# Altium project TIDA_00620.PrjPcb (part 3 of 8)
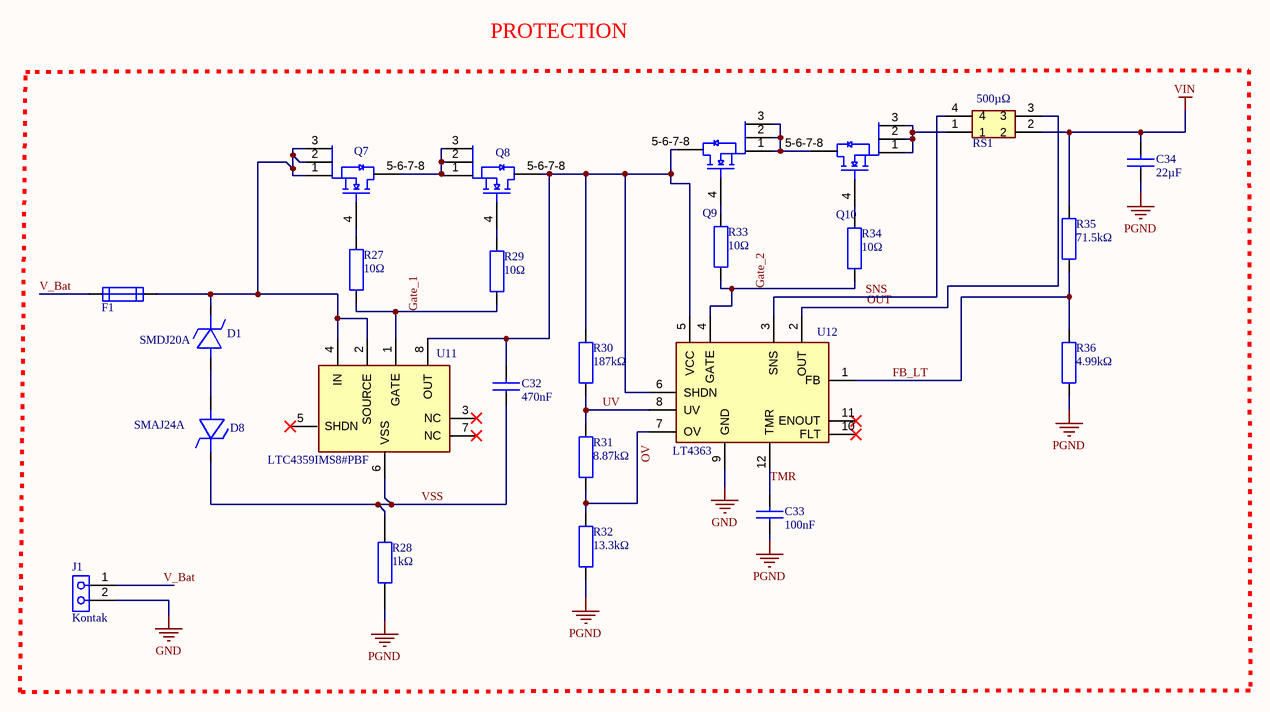
[diagram p6: Koruma.SchDoc]

## Sheet Koruma.SchDoc (continued)

### Library data of the parts (continued)
R36 = ERJ-2RKF4991X: Res Thick Film 0402 4.99K Ohm 1% 0.1W(1/10W) ±100ppm/C Pad SMD Automotive T/R; Manufacturer: Panasonic; Manufacturer Part Number: ERJ2RKF4991X; Manufacturer Lifecycle Status: ACTIVE; Part Series: Precision Thick Film Chip Resistors; Max Power Dissipation: 100mW; Temperature Coefficient: 100ppm/°C; Voltage Rating: 50V; Supplier: Farnell; Supplier Part Number: ERJ2RKF4991X; RoHS: Compliant; Category: Chip SMD Resistors; Stock: 140569; Pricing: 10=0,0178, 100=0,0146, 500=0,0095, 2500=0,0084, 5000=0,0074 (EUR); Case/Package: 0402; Case Code (Imperial): 0402; China RoHS: Non-Compliant; Composition: Thick Film; Contact Plating: Tin; Country of Origin: Japan, Mainland China; Depth: 500µm; Export Control Classification Number (ECCN) Code: EAR99; Features: Automotive AEC-Q200; Height: 350µm; Harmonized Tariff Schedule (HTS) Code: 8533.21.00.30; Introduction Date: 2004-02-02; Lead Free: Lead Free; Length: 1mm; Lifecycle Status: Production; Max Operating Temperature: 155°C; Military Standard: Not; Min Operating Temperature: -55°C; Mounting Technology: Surface Mount; Pins: 2; Number of Terminals: 2; Number of Terminations: 2; Packaging: Cut Tape; Power Rating: 100mW; Radiation Hardening: No; Ratings: AEC-Q200; REACH SVHC: Yes; Schedule B: 8533210045, 8533210045|8533210045|8533210045|8533210045|8533210045; Termination: SMD/SMT; Tolerance: 1%; Voltage Rating (DC): 50V; Weight: 793.786648µg; Width: 500µm; Working Voltage: 50V; ComponentLink1URL: https://sigma.octopart.com:443/138766958/technical_drawing/Panasonic-ERJ-2RKF4991X.pdf?src-supplier=Upverter; ComponentLink1Description: https://sigma.octopart.com:443/138766958/technical_drawing/Panasonic-ERJ-2RKF4991X.pdf?src-supplier=Upverter; ComponentLink2URL: https://datasheet.octopart.com:443/ERJ2RKF4991X-Panasonic-datasheet-82288794.pdf?src-supplier=Upverter; ComponentLink2Description: https://datasheet.octopart.com:443/ERJ2RKF4991X-Panasonic-datasheet-82288794.pdf?src-supplier=Upverter; ComponentLink3URL: https://datasheet.octopart.com:443/ERJ2RKF4991X-Panasonic-datasheet-13266541.pdf?src-supplier=RS+(Formerly+Allied+Electronics); ComponentLink3Description: https://datasheet.octopart.com:443/ERJ2RKF4991X-Panasonic-datasheet-13266541.pdf?src-supplier=RS+(Formerly+Allied+Electronics); ComponentLink4URL: https://datasheet.octopart.com:443/ERJ2RKF4991X-Panasonic-datasheet-48891056.pdf?src-supplier=Newark; ComponentLink4Description: https://datasheet.octopart.com:443/ERJ2RKF4991X-Panasonic-datasheet-48891056.pdf?src-supplier=Newark; ComponentLink5URL: https://datasheet.octopart.com:443/ERJ2RKF4991X-Panasonic-datasheet-136608610.pdf?src-supplier=Newark; ComponentLink5Description: https://datasheet.octopart.com:443/ERJ2RKF4991X-Panasonic-datasheet-136608610.pdf?src-supplier=Newark; ComponentLink6URL: https://datasheet.octopart.com:443/ERJ2RKF4991X-Panasonic-datasheet-10025800.pdf?src-supplier=Future+Electronics; ComponentLink6Description: https://datasheet.octopart.com:443/ERJ2RKF4991X-Panasonic-datasheet-10025800.pdf?src-supplier=Future+Electronics; ComponentLink7URL: https://datasheet.octopart.com:443/ERJ2RKF4991X-Panasonic-datasheet-8853621.pdf?src-supplier=Future+Electronics; ComponentLink7Description: https://datasheet.octopart.com:443/ERJ2RKF4991X-Panasonic-datasheet-8853621.pdf?src-supplier=Future+Electronics; ComponentLink8URL: https://datasheet.octopart.com:443/ERJ2RKF4991X-Panasonic-datasheet-5313456.pdf?src-supplier=Future+Electronics; ComponentLink8Description: https://datasheet.octopart.com:443/ERJ2RKF4991X-Panasonic-datasheet-5313456.pdf?src-supplier=Future+Electronics; ComponentLink9URL: https://datasheet.octopart.com:443/ERJ-2RKF4991X-Panasonic-datasheet-154766169.pdf?src-supplier=Master+Electronics; ComponentLink9Description: https://datasheet.octopart.com:443/ERJ-2RKF4991X-Panasonic-datasheet-154766169.pdf?src-supplier=Master+Electronics; ComponentLink10URL: https://datasheet.octopart.com:443/ERJ2RKF4991X-Panasonic-datasheet-188592431.pdf?src-supplier=TME; ComponentLink10Description: https://datasheet.octopart.com:443/ERJ2RKF4991X-Panasonic-datasheet-188592431.pdf?src-supplier=TME; ComponentLink11URL: https://datasheet.octopart.com:443/ERJ2RKF4991X-Panasonic-datasheet-164353789.pdf?src-supplier=TME; ComponentLink11Description: https://datasheet.octopart.com:443/ERJ2RKF4991X-Panasonic-datasheet-164353789.pdf?src-supplier=TME; ComponentLink12URL: https://datasheet.octopart.com/ERJ2RKF4991X-Panasonic-datasheet-78375410.pdf; ComponentLink12Description: https://datasheet.octopart.com/ERJ2RKF4991X-Panasonic-datasheet-78375410.pdf; ComponentLink13URL: https://datasheet.octopart.com/Precision-Thick-Film-Chip-Resistors-Panasonic-datasheet-family-106.pdf; ComponentLink13Description: https://datasheet.octopart.com/Precision-Thick-Film-Chip-Resistors-Panasonic-datasheet-family-106.pdf; ComponentLink14URL: https://datasheet.octopart.com:443/ERJ-2RKF4991X-Panasonic---ECG-datasheet-15994758.pdf?src-supplier=Farnell; ComponentLink14Description: https://datasheet.octopart.com:443/ERJ-2RKF4991X-Panasonic---ECG-datasheet-15994758.pdf?src-supplier=Farnell; ComponentLink15URL: https://datasheet.octopart.com:443/ERJ-2RKF4991X-Panasonic-datasheet-11542829.pdf?src-supplier=Arrow+Electronics; ComponentLink15Description: https://datasheet.octopart.com:443/ERJ-2RKF4991X-Panasonic-datasheet-11542829.pdf?src-supplier=Arrow+Electronics; ComponentLink16URL: https://datasheet.octopart.com:443/ERJ-2RKF4991X-Panasonic-datasheet-118621.pdf?src-supplier=DigiKey; ComponentLink16Description: https://datasheet.octopart.com:443/ERJ-2RKF4991X-Panasonic-datasheet-118621.pdf?src-supplier=DigiKey; ComponentLink17URL: https://datasheet.octopart.com:443/ERJ-2RKF4991X-Panasonic-datasheet-41391857.pdf?src-supplier=Electro+Sonic; ComponentLink17Description: https://datasheet.octopart.com:443/ERJ-2RKF4991X-Panasonic-datasheet-41391857.pdf?src-supplier=Electro+Sonic
RS1 = WSLP4026L5000FEA: Res Metal Strip 4026 0.0005 Ohm 1% 7W ±75ppm/C Metal Pad SMD Automotive T/R; Manufacturer: Vishay; Temperature Coefficient: 75ppm/°C; Working Voltage: 59.2mV; Supplier: Future Electronics; Supplier Part Number: WSLP4026L5000FEA; Manufacturer Part Number: WSLP4026L5000FEA; RoHS: Compliant; Category: Chip SMD Resistors; Pricing: 1500=2 (USD); Case/Package: 4026; Case Code (Imperial): 4026; Case Code (Metric): 1066; China RoHS: Compliant; Composition: Metal Strip; Features: Moisture Resistant; Height: 2.95mm; Length: 10.1mm; Lifecycle Status: Production; Max Operating Temperature: 170°C; Max Power Dissipation: 7W; Min Operating Temperature: -65°C; Mounting Technology: Surface Mount; Number of Terminals: 4; Number of Terminations: 4; Power Rating: 7W; Ratings: AEC-Q200; REACH SVHC: Yes; Tolerance: 1%; Width: 6.6mm; ComponentLink1URL: https://datasheet.octopart.com:443/WSLP4026L5000FEA-Vishay-datasheet-181963782.pdf?src-supplier=IHS; ComponentLink1Description: https://datasheet.octopart.com:443/WSLP4026L5000FEA-Vishay-datasheet-181963782.pdf?src-supplier=IHS; ComponentLink2URL: https://datasheet.octopart.com:443/WSLP4026L5000FEA-Vishay-datasheet-62319862.pdf?src-supplier=Newark; ComponentLink2Description: https://datasheet.octopart.com:443/WSLP4026L5000FEA-Vishay-datasheet-62319862.pdf?src-supplier=Newark; ComponentLink3URL: https://datasheet.octopart.com:443/WSLP4026L5000FEA-Vishay-datasheet-25365648.pdf?src-supplier=Newark; ComponentLink3Description: https://datasheet.octopart.com:443/WSLP4026L5000FEA-Vishay-datasheet-25365648.pdf?src-supplier=Newark; ComponentLink4URL: https://datasheet.octopart.com:443/WSLP4026L5000FEA-Vishay-datasheet-179246766.pdf?src-supplier=TME; ComponentLink4Description: https://datasheet.octopart.com:443/WSLP4026L5000FEA-Vishay-datasheet-179246766.pdf?src-supplier=TME; ComponentLink5URL: https://datasheet.octopart.com:443/WSLP4026L5000FEA-Vishay-datasheet-83134227.pdf?src-supplier=Future+Electronics; ComponentLink5Description: https://datasheet.octopart.com:443/WSLP4026L5000FEA-Vishay-datasheet-83134227.pdf?src-supplier=Future+Electronics; ComponentLink6URL: http://sigma.octopart.com:80/rohs_statement/Vishay-company-15.pdf?src-supplier=Compliance+Statements; ComponentLink6Description: http://sigma.octopart.com:80/rohs_statement/Vishay-company-15.pdf?src-supplier=Compliance+Statements
U11 = LTC4359IMS8#PBF: OR Controller N-Channel Single Automotive 8-Pin MSOP Tube / IC OR CTRLR N+1 8MSOP; Manufacturer: Analog Devices; Manufacturer Lifecycle Status: PRODUCTION; Max Output current: 180mA; Max Supply Voltage: 80V; Min Supply Voltage: 4V; Nominal Supply Current: 150µA; Number of Drivers: 1; Turn-Off Delay Time: 500ns; Supplier: Farnell; Supplier Part Number: LTC4359IMS8#PBF; Manufacturer Part Number: LTC4359IMS8#PBF; RoHS: Compliant; Category: Hot Swap Controllers; Stock: 348; Pricing: 1=9,08, 10=7,02, 50=6,69, 100=5,8, 250=5,55, 500=5,44 (EUR); Case/Package: MSOP; Lead Free: Lead Free; Lifecycle Status: Production; Max Operating Temperature: 85°C; Min Operating Temperature: -40°C; Number of Outputs: 1; Pins: 8; Schedule B: 8542310000, 8542390000, 8542390000|8542390000|8542390000|8542390000|8542390000|8542390000|8542390000|8542390000|8542390000|8542390000|8542390000|8542390000|8542390000|8542390000|8542390000|8542390000|8542390000|8542390000|8542390000|8542390000|8542390000|8542390000|8542390000|85; ComponentLink1URL: https://octopart.com:443/opatz8j6/c1?t=_P40TfJSJXDZt56jomm_QCaV2W9ovGhsmmsOr-jhAwoCJ8nBLABmPJZhMtd9jjF5hxL1_00-h1PSZMWNgisxjLor_nTRai5VSPSv7C30GKc6fB5Irl3JnoxXP6guWu3apPr0PFiiVpLUoXbJVRp6NFZQZkSSQtA-ym9nyDkwm4hFZ6aPWkuTkGMSIQRbKLFRiG3TpYClyGIEk8cre1-RNpxUfVtqVrzznXBdFvjW7k8HJfomxoh2QY9RslEN6MsN_sQCc8xlBgnroxPUy_RknD4svorm-bCFLp_eYvwDcJ65KenarPCoDA&src-supplier=Analog+Devices; ComponentLink1Description: https://octopart.com:443/opatz8j6/c1?t=_P40TfJSJXDZt56jomm_QCaV2W9ovGhsmmsOr-jhAwoCJ8nBLABmPJZhMtd9jjF5hxL1_00-h1PSZMWNgisxjLor_nTRai5VSPSv7C30GKc6fB5Irl3JnoxXP6guWu3apPr0PFiiVpLUoXbJVRp6NFZQZkSSQtA-ym9nyDkwm4hFZ6aPWkuTkGMSIQRbKLFRiG3TpYClyGIEk8cre1-RNpxUfVtqVrzznXBdFvjW7k8HJfomxoh2QY9RslEN6MsN_sQCc8xlBgnroxPUy_RknD4svorm-bCFLp_eYvwDcJ65KenarPCoDA&src-supplier=Analog+Devices; ComponentLink2URL: https://datasheet.octopart.com:443/LTC4359IMS8%23PBF-Analog-Devices-datasheet-140795748.pdf?src-supplier=element14+APAC; ComponentLink2Description: https://datasheet.octopart.com:443/LTC4359IMS8%23PBF-Analog-Devices-datasheet-140795748.pdf?src-supplier=element14+APAC; ComponentLink3URL: https://datasheet.octopart.com:443/LTC4359IMS8%23PBF-Analog-Devices-datasheet-158590489.pdf?src-supplier=Augswan; ComponentLink3Description: https://datasheet.octopart.com:443/LTC4359IMS8%23PBF-Analog-Devices-datasheet-158590489.pdf?src-supplier=Augswan; ComponentLink4URL: https://datasheet.octopart.com:443/LTC4359IMS8%23PBF-Linear-Technology-datasheet-57717354.pdf?src-supplier=Linear+Technology; ComponentLink4Description: https://datasheet.octopart.com:443/LTC4359IMS8%23PBF-Linear-Technology-datasheet-57717354.pdf?src-supplier=Linear+Technology; ComponentLink5URL: https://sigma.octopart.com:443/57689691/technical_drawing/Linear-Technology-LTC4359IMS8%23PBF.pdf?src-supplier=Linear+Technology; ComponentLink5Description: https://sigma.octopart.com:443/57689691/technical_drawing/Linear-Technology-LTC4359IMS8%23PBF.pdf?src-supplier=Linear+Technology; ComponentLink6URL: https://datasheet.octopart.com:443/LTC4359IMS8%23PBF-Linear-Technology-datasheet-11773680.pdf?src-supplier=Arrow+Electronics; ComponentLink6Description: https://datasheet.octopart.com:443/LTC4359IMS8%23PBF-Linear-Technology-datasheet-11773680.pdf?src-supplier=Arrow+Electronics; ComponentLink7URL: https://datasheet.octopart.com:443/LTC4359IMS8%23PBF-Analog-Devices-datasheet-14357927.pdf?src-supplier=Newchip+Electronics+Limited; ComponentLink7Description: https://datasheet.octopart.com:443/LTC4359IMS8%23PBF-Analog-Devices-datasheet-14357927.pdf?src-supplier=Newchip+Electronics+Limited; ComponentLink8URL: http://sigma.octopart.com:80/conflict_mineral_statement/Analog-Devices-company-33.pdf?src-supplier=Compliance+Statements; ComponentLink8Description: http://sigma.octopart.com:80/conflict_mineral_statement/Analog-Devices-company-33.pdf?src-supplier=Compliance+Statements; ComponentLink9URL: https://octopart.com:443/opatz8j6/c1?t=XMv486en4cgRczUhByXESygA7tzcWfPA65o52ghxq4CXCY5NS57rdy5GGbwVE8XfZyKs-Pss4HrKqDtDv8emV_VCOba_2B0i215LcHmypdXyqbKoV6hHKkyeszMd1G80nbJlVl28xOaq3ImAQwkx3MBKoeKSCRUWEeTh7O6SnaO6lulbOrhBpa7lUpYX2qexamutmNVBBP7Kuf_BfwVA6xNgWJaaLpoQaJnsVBxMCYgV8GT8S6w0VND9CLazxAvXxfuvXrc9_2mcoElFnkU-aAFDwJb3cbIgcdgtTW9GLMnN3gYe9mDzlQ&src-supplier=Compliance+Statements; ComponentLink9Description: https://octopart.com:443/opatz8j6/c1?t=XMv486en4cgRczUhByXESygA7tzcWfPA65o52ghxq4CXCY5NS57rdy5GGbwVE8XfZyKs-Pss4HrKqDtDv8emV_VCOba_2B0i215LcHmypdXyqbKoV6hHKkyeszMd1G80nbJlVl28xOaq3ImAQwkx3MBKoeKSCRUWEeTh7O6SnaO6lulbOrhBpa7lUpYX2qexamutmNVBBP7Kuf_BfwVA6xNgWJaaLpoQaJnsVBxMCYgV8GT8S6w0VND9CLazxAvXxfuvXrc9_2mcoElFnkU-aAFDwJb3cbIgcdgtTW9GLMnN3gYe9mDzlQ&src-supplier=Compliance+Statements
U12 = LT4363IMS-2#PBF: Circuit Protection Misc High Voltage Surge Stopper with Current Limit; Manufacturer: Analog Devices; Manufacturer Part Number: LT4363MPMS-1#TRPBF; Manufacturer Lifecycle Status: PRODUCTION; Clamping Voltage: 27V; Number of Circuits: 1; Working Voltage: 80V; Min Supply Voltage: 4V; Nominal Supply Voltage: 12V; Nominal Supply Current: 700µA; Supplier: Arrow Electronics; Supplier Part Number: LT4363MPMS-1#TRPBF; RoHS: Compliant; Category: Hot Swap Controllers; Pricing: 2500=13,8449 (USD); Lifecycle Status: Production; Pins: 12; Packaging: Tape and Reel; ComponentLink1URL: https://octopart.com:443/opatz8j6/c1?t=g8yZI-WwmnHB_vbMX34rM1w-FVIDuFRStvEBEGjv-t7dY-yn6edyVpvHiGWVwXk36mJtHaakebzYH0pbcDC9nAFzvMX55UE01VpBw0EvuzOYQuQyHVXSkEwA9UrcLhArsI8crRkas2E3x20SSd_j0bG3UdC2S3P2-55djwoCcbCa9x_vW4mWI6Pbbhes42ab_Mm48tbaz0AMQirVxpVGA3itoBnPvYNW2nXIrlFGQrOJUnHEnTZGMHqmHwXgR_Tlx3P7WXantRchJJux0Cl3oIBQ6pMTohaApkUOsGSDa4JuYPEXn45JWQ&src-supplier=Analog+Devices; ComponentLink1Description: https://octopart.com:443/opatz8j6/c1?t=g8yZI-WwmnHB_vbMX34rM1w-FVIDuFRStvEBEGjv-t7dY-yn6edyVpvHiGWVwXk36mJtHaakebzYH0pbcDC9nAFzvMX55UE01VpBw0EvuzOYQuQyHVXSkEwA9UrcLhArsI8crRkas2E3x20SSd_j0bG3UdC2S3P2-55djwoCcbCa9x_vW4mWI6Pbbhes42ab_Mm48tbaz0AMQirVxpVGA3itoBnPvYNW2nXIrlFGQrOJUnHEnTZGMHqmHwXgR_Tlx3P7WXantRchJJux0Cl3oIBQ6pMTohaApkUOsGSDa4JuYPEXn45JWQ&src-supplier=Analog+Devices; ComponentLink2URL: https://datasheet.octopart.com:443/LT4363MPMS-1%23TRPBF-Linear-Technology-datasheet-16808119.pdf?src-supplier=Upverter; ComponentLink2Description: https://datasheet.octopart.com:443/LT4363MPMS-1%23TRPBF-Linear-Technology-datasheet-16808119.pdf?src-supplier=Upverter; ComponentLink3URL: https://datasheet.octopart.com:443/LT4363MPMS-1%23TRPBF-Analog-Devices-datasheet-48003674.pdf?src-supplier=Newchip+Electronics+Limited; ComponentLink3Description: https://datasheet.octopart.com:443/LT4363MPMS-1%23TRPBF-Analog-Devices-datasheet-48003674.pdf?src-supplier=Newchip+Electronics+Limited; ComponentLink4URL: https://sigma.octopart.com:443/57695431/technical_drawing/Linear-Technology-LT4363MPMS-1%23TRPBF.pdf?src-supplier=Linear+Technology; ComponentLink4Description: https://sigma.octopart.com:443/57695431/technical_drawing/Linear-Technology-LT4363MPMS-1%23TRPBF.pdf?src-supplier=Linear+Technology; ComponentLink5URL: http://sigma.octopart.com:80/conflict_mineral_statement/Analog-Devices-company-33.pdf?src-supplier=Compliance+Statements; ComponentLink5Description: http://sigma.octopart.com:80/conflict_mineral_statement/Analog-Devices-company-33.pdf?src-supplier=Compliance+Statements; ComponentLink6URL: https://octopart.com:443/opatz8j6/c1?t=upX8bGaY0C_XhAgK0tvuE4KuG34pd1dqjCgMGSFl4A4VfJwnA-G2iPp1-_xl9tlvp47bIYjpGNIjJgQeIzPXlpvhsBRu-ZZqvMGXOy-0TvtKIjLrlnKqpwMA3gUbHz7op1PS0t33v5G0SwlTw0DW8UOb0qzWfk6qHP7B7oxV7v4SQDT7Kv3aFCYxemazye3958pU0imV6PXlzZXgUE6TdK9BZeuQDHDxv2Lx3eHIn183-cqc5tcQD9qR7x6H9J_DywiqtQ8guaVb2EPAcjERqDFoPchTgqXMyI2T8b-Hn7iuDHJnAWewLw&src-supplier=Compliance+Statements; ComponentLink6Description: https://octopart.com:443/opatz8j6/c1?t=upX8bGaY0C_XhAgK0tvuE4KuG34pd1dqjCgMGSFl4A4VfJwnA-G2iPp1-_xl9tlvp47bIYjpGNIjJgQeIzPXlpvhsBRu-ZZqvMGXOy-0TvtKIjLrlnKqpwMA3gUbHz7op1PS0t33v5G0SwlTw0DW8UOb0qzWfk6qHP7B7oxV7v4SQDT7Kv3aFCYxemazye3958pU0imV6PXlzZXgUE6TdK9BZeuQDHDxv2Lx3eHIn183-cqc5tcQD9qR7x6H9J_DywiqtQ8guaVb2EPAcjERqDFoPchTgqXMyI2T8b-Hn7iuDHJnAWewLw&src-supplier=Compliance+Statements; Stock: 74; Case/Package: MSOP; Height: 860µm; Lead Free: Lead Free; Length: 4.04mm; Max Operating Temperature: 85°C; Max Supply Voltage: 80V; Min Operating Temperature: -40°C; REACH SVHC: No; Schedule B: 8542390000, 8542390000|8542390000|8542390000|8542390000|8542390000; Width: 3mm; ComponentLink7URL: https://datasheet.octopart.com:443/LT4363IMS-2%23PBF-Analog-Devices-datasheet-16808119.pdf?src-supplier=Upverter; ComponentLink7Description: https://datasheet.octopart.com:443/LT4363IMS-2%23PBF-Analog-Devices-datasheet-16808119.pdf?src-supplier=Upverter; ComponentLink8URL: https://octopart.com:443/opatz8j6/c1?t=-IHcXZz8wf17Co3lJavFHjPk-jkjkbeE4FdSPYckKG-W26AH8QtQvgpVO8pSyIYJH4MIluO-quCPdq0IYsrL5xEJfkoWcv9ETdU4LRmwEu_QaNUHWW1x1p2NOujrI1czxFPuXzgNB89LoG9zMgWoaE8idJS3WKmYLS9sBBfM7ivdFLcJ03sPEP5W3TyyvmJEisV6tOozvhDCwz-NbNr_qWq7vIv3e2u2OtMyOZeqdy9MQ7VmyH1OnZ3GHaGImkjZNX9WHhXeQsYdpNQJx9v8Dd7EIeMeRmu2NjR7aH39sP_VGgL-3JzLxA&src-supplier=Analog+Devices; ComponentLink8Description: https://octopart.com:443/opatz8j6/c1?t=-IHcXZz8wf17Co3lJavFHjPk-jkjkbeE4FdSPYckKG-W26AH8QtQvgpVO8pSyIYJH4MIluO-quCPdq0IYsrL5xEJfkoWcv9ETdU4LRmwEu_QaNUHWW1x1p2NOujrI1czxFPuXzgNB89LoG9zMgWoaE8idJS3WKmYLS9sBBfM7ivdFLcJ03sPEP5W3TyyvmJEisV6tOozvhDCwz-NbNr_qWq7vIv3e2u2OtMyOZeqdy9MQ7VmyH1OnZ3GHaGImkjZNX9WHhXeQsYdpNQJx9v8Dd7EIeMeRmu2NjR7aH39sP_VGgL-3JzLxA&src-supplier=Analog+Devices; ComponentLink9URL: https://datasheet.octopart.com:443/LT4363IMS-2%23PBF-Analog-Devices-datasheet-157246151.pdf?src-supplier=Newchip+Electronics+Limited; ComponentLink9Description: https://datasheet.octopart.com:443/LT4363IMS-2%23PBF-Analog-Devices-datasheet-157246151.pdf?src-supplier=Newchip+Electronics+Limited; ComponentLink10URL: https://sigma.octopart.com:443/57695431/technical_drawing/Linear-Technology-LT4363IMS-2%23PBF.pdf?src-supplier=Linear+Technology; ComponentLink10Description: https://sigma.octopart.com:443/57695431/technical_drawing/Linear-Technology-LT4363IMS-2%23PBF.pdf?src-supplier=Linear+Technology; ComponentLink11URL: https://datasheet.octopart.com:443/LT4363IMS-2%23PBF-Linear-Technology-datasheet-11557070.pdf?src-supplier=Arrow+Electronics; ComponentLink11Description: https://datasheet.octopart.com:443/LT4363IMS-2%23PBF-Linear-Technology-datasheet-11557070.pdf?src-supplier=Arrow+Electronics; ComponentLink12URL: https://datasheet.octopart.com:443/LT4363IMS-2%23PBF-Linear-Technology-datasheet-10915746.pdf?src-supplier=Farnell; ComponentLink12Description: https://datasheet.octopart.com:443/LT4363IMS-2%23PBF-Linear-Technology-datasheet-10915746.pdf?src-supplier=Farnell; ComponentLink13URL: https://datasheet.octopart.com:443/LT4363IMS-2%23PBF-Linear-Technology-datasheet-10704508.pdf?src-supplier=Component+Distributors+Inc.; ComponentLink13Description: https://datasheet.octopart.com:443/LT4363IMS-2%23PBF-Linear-Technology-datasheet-10704508.pdf?src-supplier=Component+Distributors+Inc.; ComponentLink14URL: https://octopart.com:443/opatz8j6/c1?t=ov3Kxoe_DC7fAzVY9nj0-62S96ULmO_6ZbMSPat3xYGpsnqzj5canMsxfoRN1ZRc_18gTD_GsfnKt9q-ufd8fGCuFQtTIEPt1KoRkOURSC3Oguhxm71ep0Cxh36by45lKF4SedGJb6NO9ztMtBZMWLsztLg5ZHghx9ADcRyN_CBXFw39hroyNObFrqWfVziCGXaFT18OGdeRBSZDlnW_MpVfTXUUrmwnAM1coZsA5MeT4wFdsSjiSTl4renPEe9RbKBU6R7PCV5lcK1j4lQVbinNQ__ejP83fk6F6QwqnfKsYZRM15WY3A&src-supplier=Compliance+Statements; ComponentLink14Description: https://octopart.com:443/opatz8j6/c1?t=ov3Kxoe_DC7fAzVY9nj0-62S96ULmO_6ZbMSPat3xYGpsnqzj5canMsxfoRN1ZRc_18gTD_GsfnKt9q-ufd8fGCuFQtTIEPt1KoRkOURSC3Oguhxm71ep0Cxh36by45lKF4SedGJb6NO9ztMtBZMWLsztLg5ZHghx9ADcRyN_CBXFw39hroyNObFrqWfVziCGXaFT18OGdeRBSZDlnW_MpVfTXUUrmwnAM1coZsA5MeT4wFdsSjiSTl4renPEe9RbKBU6R7PCV5lcK1j4lQVbinNQ__ejP83fk6F6QwqnfKsYZRM15WY3A&src-supplier=Compliance+Statements

## Sheet Güç ve Koruma.SchDoc
size A4; SheetNumber: 2; SheetTotal: 5
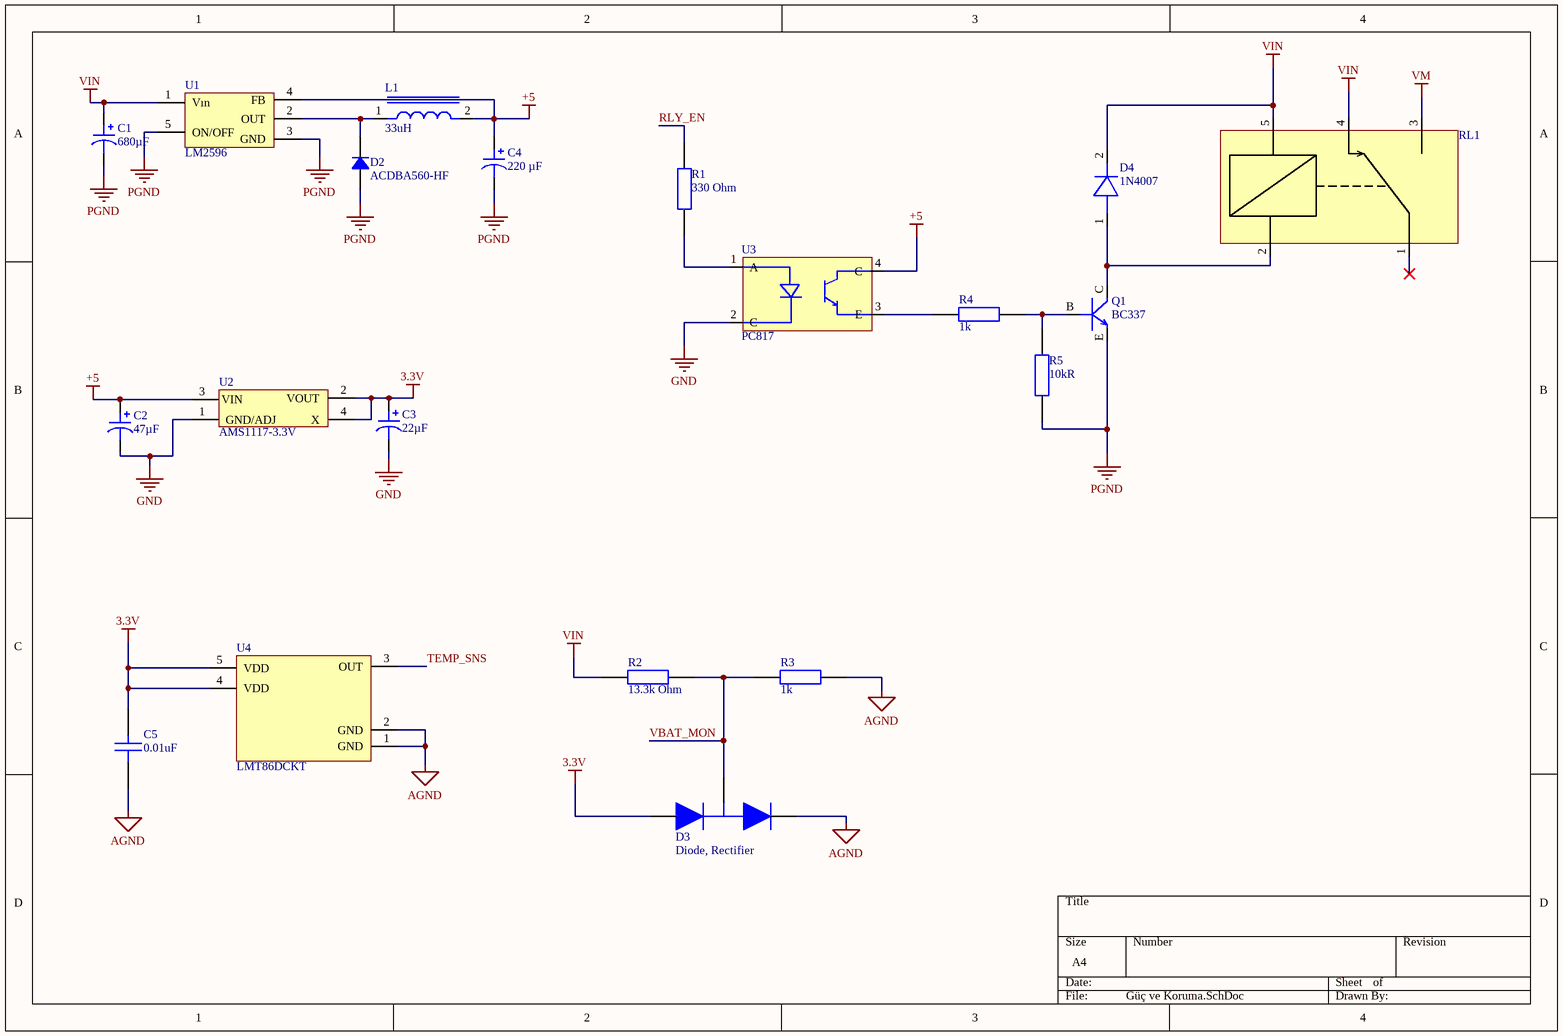
[diagram p1: Güç ve Koruma.SchDoc]

### Parts
C1  680µF  [CAP TH ALUM ELEC D12.50mm S5.00mm H30.00mm]
C2  47µF  [CAP TH ALUM ELEC D6.30mm S2.50mm H6.00mm]
C3  22µF  [CAP TH ALUM ELEC D6.30mm S2.50mm H12.00mm]
C4  220 µF  [CAP AL TH D8 L3.5 H12.5]
C5  0.01uF  [CAP0603- GRM188R70J103KA01D]
D2  ACDBA560-HF  [DO214AC SMA]
D3  Diode, Rectifier  [SOT-23-3 - MMBD7000LT1G]
D4  1N4007  [1N4007]
L1  33uH  [Cap33Uh]
Q1  BC337  [BC337]
R1  330 Ohm  [RES0603- RC0603FR-07330RL]
R2  13.3k Ohm  [RES0402]
R3  1k  [RES0402]
R4  1k  [RES0402]
R5  Resistance: 10kR  [RES_0603]  (hidden comment: RC0603FR-0710KL)
RL1  HK15F-DC24V-S-K  [HK15F-DC24V-S-K]  (value not drawn)
U1  LM2596  [LM2596]
U2  AMS1117-3.3V  [SOT223]
U3  PC817  [PC817]
U4  LMT86DCKT  [LMT86DCKT]

### Nets
3.3V: C3.1 C5.2 D3.1 U2.2(VOUT) U2.4(X) U4.4(VDD) U4.5(VDD)
+5: C2.1 C4.1 L1.2 U1.4(FB) U2.3(VIN) U3.4(C)
AGND: C5.1 D3.2 R3.2 U4.1(GND) U4.2(GND)
GND: C2.2 C3.2 U2.1(GND/ADJ) U3.2(C)
PGND: C1.2 C4.2 D2.1 Q1.E R5.2 U1.3(GND) U1.5(ON/OFF)
VIN: C1.1 D4.2 R2.1 RL1.4 RL1.5 U1.1(Vın)
VM: RL1.3
RLY_EN: R1.1
TEMP_SNS: U4.3(OUT)
VBAT_MON: D3.3 R2.2 R3.1
NetD2_2: D2.2 L1.1 U1.2(OUT)
NetD4_1: D4.1 Q1.C RL1.2
NetQ1_B: Q1.B R4.2 R5.1
NetR1_2: R1.2 U3.1(A)
NetR4_1: R4.1 U3.3(E)

Not connected (* = marked no-connect by the designer): RL1 1*